# Altium project BMS_MASTER.PrjPcb
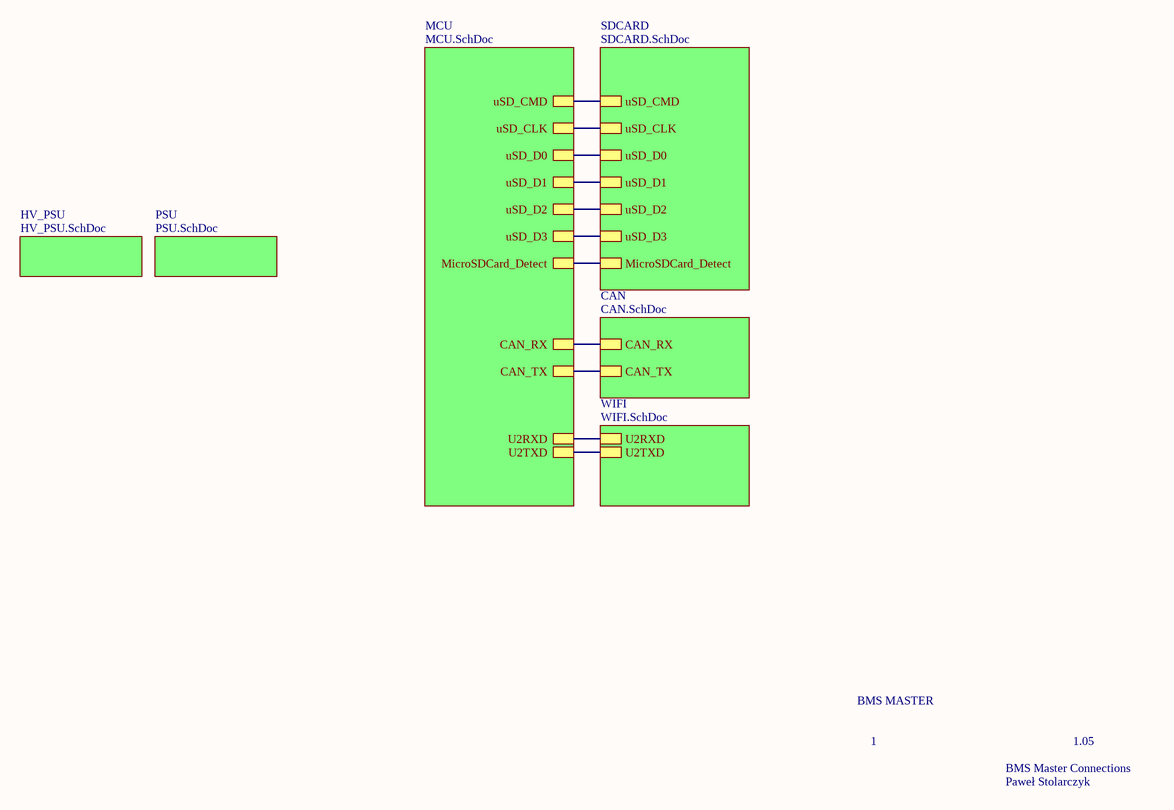
[diagram p0: BMS_MASTER.SchDoc]
7 sheets, 101 parts. Net scope: hierarchical (ports join the sheet entries above them; power ports are global).
Board file: BMS_MASTER.PcbDoc
Sheets:
  BMS_MASTER.SchDoc
    MCU = MCU.SchDoc
    PSU = PSU.SchDoc
    SDCARD = SDCARD.SchDoc
    WIFI = WIFI.SchDoc
    CAN = CAN.SchDoc
    HV_PSU = HV_PSU.SchDoc

## Sheet BMS_MASTER.SchDoc
size A4; SheetNumber: 1; SheetTotal: 7

### Sub-sheets
CAN = CAN.SchDoc: CAN_RX, CAN_TX
HV_PSU = HV_PSU.SchDoc: no entries
MCU = MCU.SchDoc: uSD_CMD, uSD_CLK, uSD_D0, uSD_D1, uSD_D2, uSD_D3, MicroSDCard_Detect, CAN_RX, CAN_TX, U2RXD, U2TXD
PSU = PSU.SchDoc: no entries
SDCARD = SDCARD.SchDoc: uSD_CMD, uSD_CLK, uSD_D0, uSD_D1, uSD_D2, uSD_D3, MicroSDCard_Detect
WIFI = WIFI.SchDoc: U2RXD, U2TXD

### Nets
CAN_RX: sheet MCU/CAN_RX, sheet CAN/CAN_RX
CAN_TX: sheet MCU/CAN_TX, sheet CAN/CAN_TX
IO16: sheet MCU/U2RXD, sheet WIFI/U2RXD
IO17: sheet MCU/U2TXD, sheet WIFI/U2TXD
PB6: sheet MCU/MicroSDCard_Detect, sheet SDCARD/MicroSDCard_Detect
PC8: sheet MCU/uSD_D0, sheet SDCARD/uSD_D0
PC9: sheet MCU/uSD_D1, sheet SDCARD/uSD_D1
PC10: sheet MCU/uSD_D2, sheet SDCARD/uSD_D2
PC11: sheet MCU/uSD_D3, sheet SDCARD/uSD_D3
PC12: sheet MCU/uSD_CLK, sheet SDCARD/uSD_CLK
PD2: sheet MCU/uSD_CMD, sheet SDCARD/uSD_CMD

### Notes on the sheet
- BMS MASTER
- 1
- BMS Master Connections
- 1.05
- Paweł Stolarczyk

## Sheet MCU.SchDoc
size A3; SheetNumber: 2; SheetTotal: 7
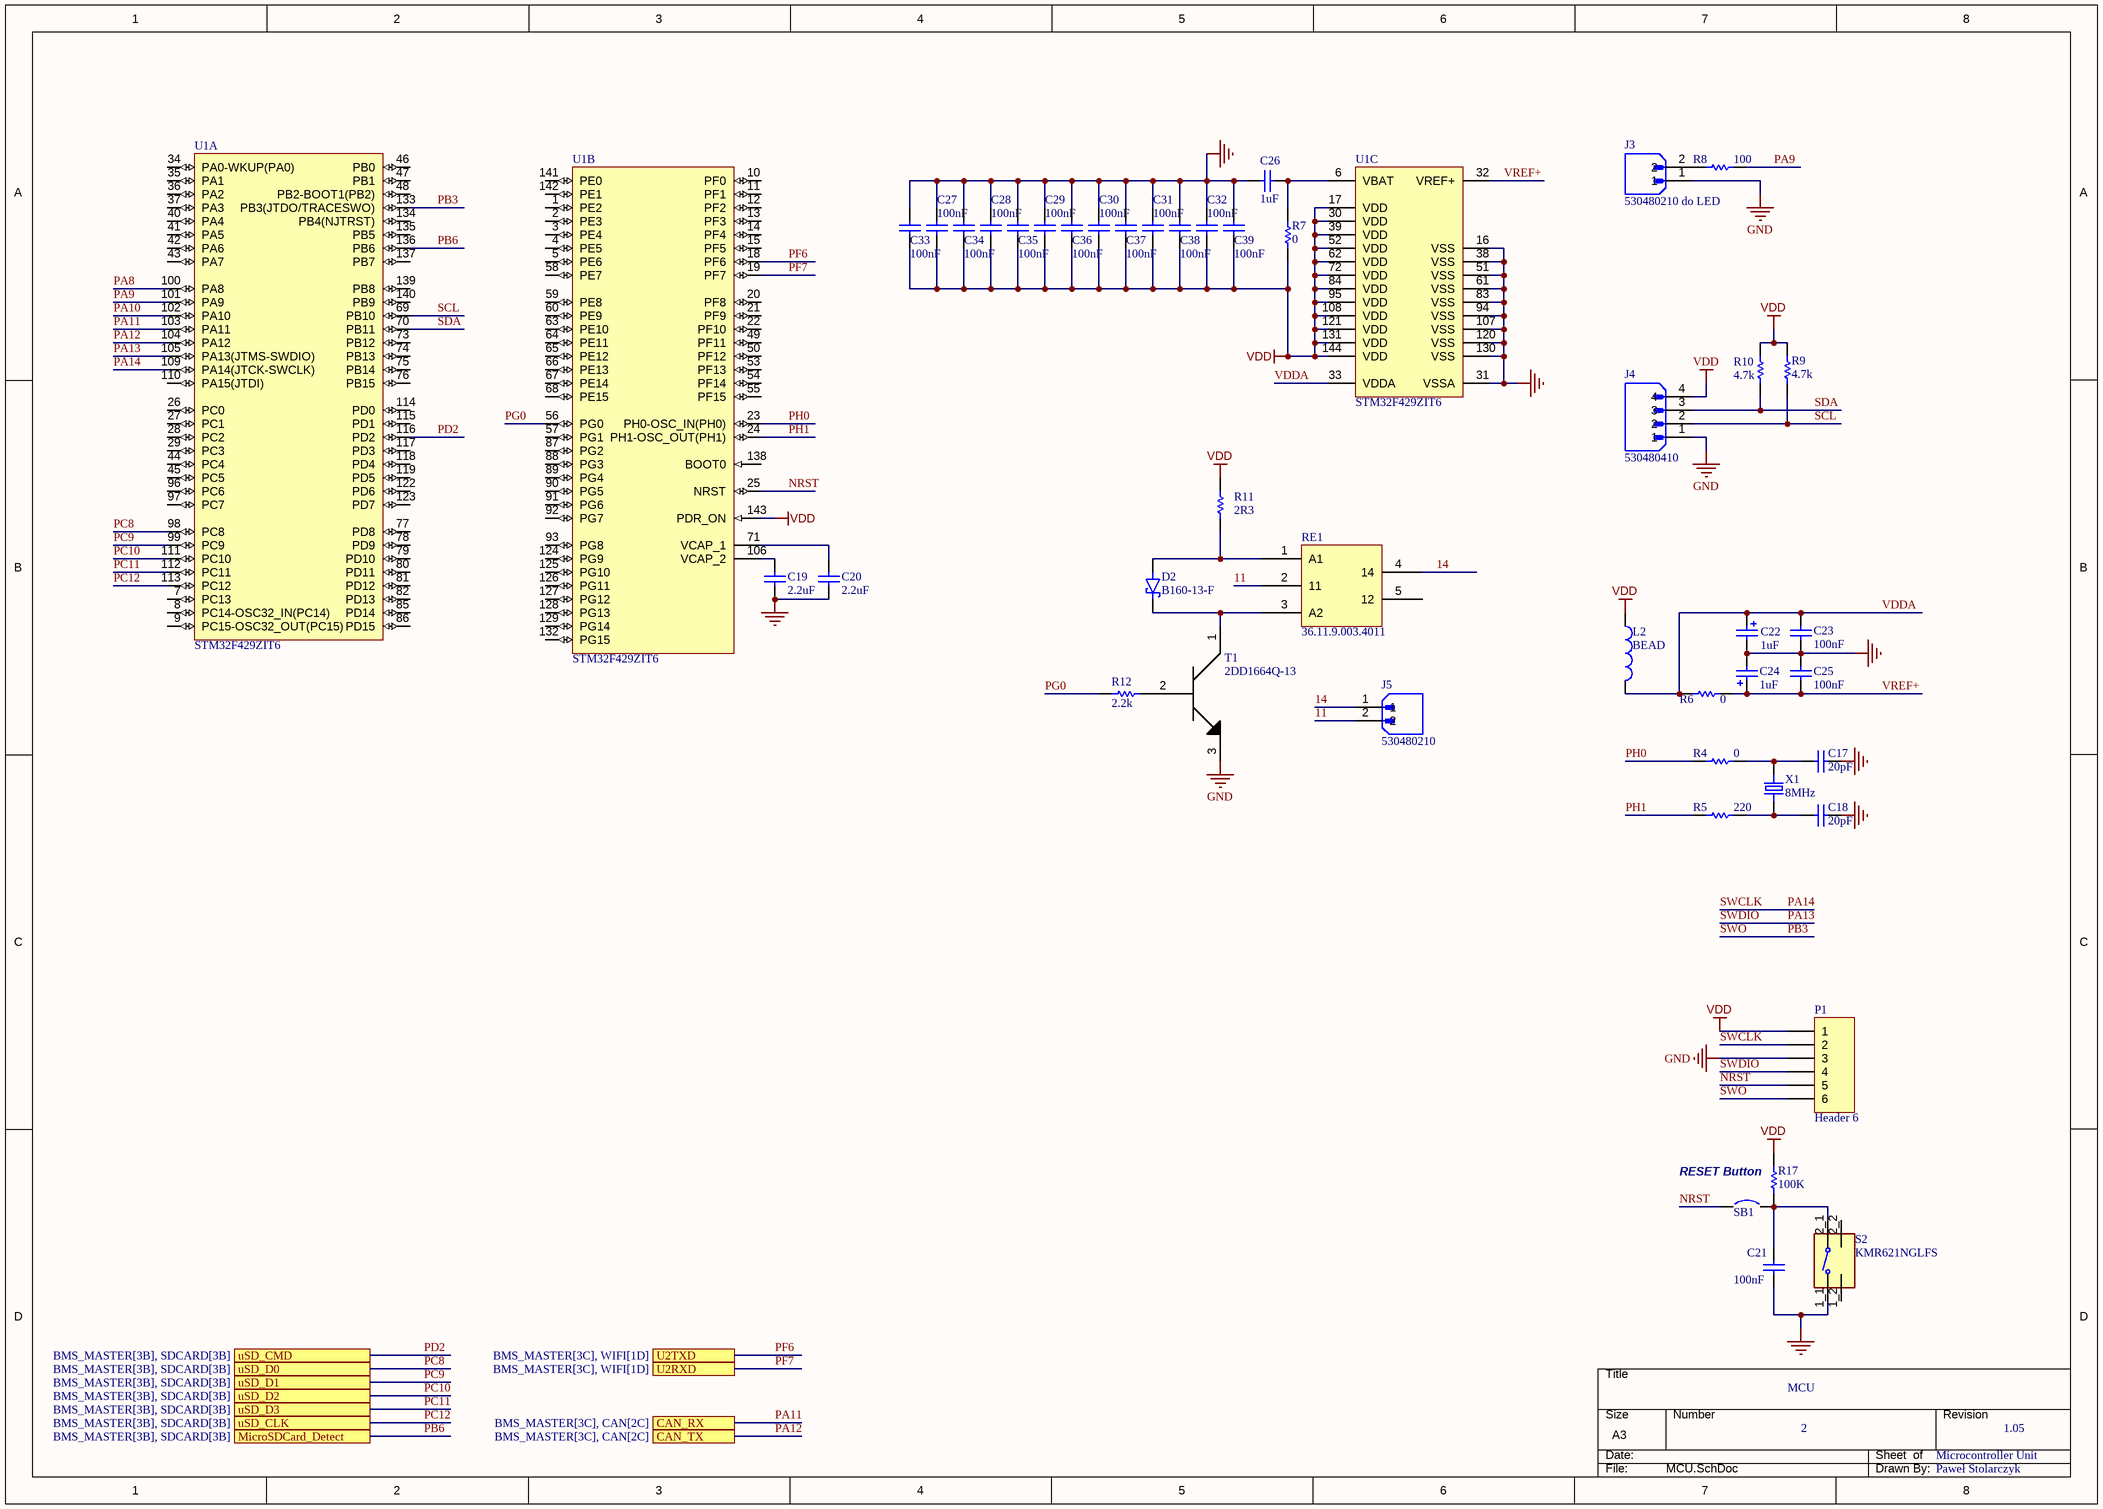
[diagram p1: MCU.SchDoc]

### Parts
C17  20pF  [0402]
C18  20pF  [0402]
C19  2.2uF  [C1206]
C20  2.2uF  [C1206]
C21  100nF  [0402]
C22  1uF  [C1206]
C23  100nF  [0402]
C24  1uF  [C1206]
C25  100nF  [0402]
C26  1uF  [C1206]
C27  100nF  [0402]
C28  100nF  [0402]
C29  100nF  [0402]
C30  100nF  [0402]
C31  100nF  [0402]
C32  100nF  [0402]
C33  100nF  [0402]
C34  100nF  [0402]
C35  100nF  [0402]
C36  100nF  [0402]
C37  100nF  [0402]
C38  100nF  [0402]
C39  100nF  [0402]
D2  B160-13-F  [DIODE_B160-13-F]
J3  530480210 do LED  [MOLEX_530480210]
J4  530480410  [MOLEX_530480410]
J5  530480210  [MOLEX_530480210]
L2  BEAD  [0402]
P1  Header 6  [HDR1X6]
R4  0  [0402]
R5  220  [0402]
R6  0  [0402]
R7  0  [0402]
R8  100  [0402]
R9  4.7k  [0402]
R10  4.7k  [0402]
R11  value 2R3  [C1206]  (hidden comment: Res1)
R12  2.2k  [0402]
R17  100K  [0402]
RE1  36.11.9.003.4011  [36.11.9.003.4011]
S2  KMR621NGLFS  [SW_KMR621NGLFS]
SB1  Circuit Breaker  [0402]  (value not drawn)
T1  2DD1664Q-13  [SOT150P410X160-3N]
U1  STM32F429ZIT6  [STM-LQFP144_N]  (parts A,B,C of 3)
X1  8MHz  [8M-49S-SR]

### Ports
CAN_RX (see BMS_MASTER[3C], CAN[2C]), CAN_TX (see BMS_MASTER[3C], CAN[2C]), MicroSDCard_Detect (see BMS_MASTER[3B], SDCARD[3B]), U2RXD (see BMS_MASTER[3C], WIFI[1D]), U2TXD (see BMS_MASTER[3C], WIFI[1D]), uSD_CLK (see BMS_MASTER[3B], SDCARD[3B]), uSD_CMD (see BMS_MASTER[3B], SDCARD[3B]), uSD_D0 (see BMS_MASTER[3B], SDCARD[3B]), uSD_D1 (see BMS_MASTER[3B], SDCARD[3B]), uSD_D2 (see BMS_MASTER[3B], SDCARD[3B]), uSD_D3 (see BMS_MASTER[3B], SDCARD[3B])

### Nets
GND: C17.2 C18.2 C19.2 C20.2 C21.1 C22.2 C23.1 C24.2 C25.2 C26.1 C27.2 C28.2 C29.2 C30.2 C31.2 C32.2 C33.2 C34.2 C35.2 C36.2 C37.2 C38.2 C39.2 J3.1 J4.1 P1.3 S2.1_1 T1.3 U1.16(VSS) U1.31(VSSA) U1.38(VSS) U1.51(VSS) U1.61(VSS) U1.83(VSS) U1.94(VSS) U1.107(VSS) U1.120(VSS) U1.130(VSS)
VDD: C27.1 C28.1 C29.1 C30.1 C31.1 C32.1 C33.1 C34.1 C35.1 C36.1 C37.1 C38.1 C39.1 J4.4 L2.1 P1.1 R7.1 R9.1 R10.1 R11.2 R17.2 U1.17(VDD) U1.30(VDD) U1.39(VDD) U1.52(VDD) U1.62(VDD) U1.72(VDD) U1.84(VDD) U1.95(VDD) U1.108(VDD) U1.121(VDD) U1.131(VDD) U1.143(PDR_ON) U1.144(VDD)
11: J5.2 RE1.2(11)
14: J5.1 RE1.4(14)
NRST: P1.5 SB1.1 U1.25(NRST)
PA8: U1.100(PA8)
PA9: R8.2 U1.101(PA9)
PA10: U1.102(PA10)
PA11: U1.103(PA11) ; port CAN_RX  [project net CAN_RX]
PA12: U1.104(PA12) ; port CAN_TX  [project net CAN_TX]
PA13: P1.4 U1.105(PA13(JTMS-SWDIO))  [also labelled SWDIO]
PA14: P1.2 U1.109(PA14(JTCK-SWCLK))  [also labelled SWCLK]
PB3: P1.6 U1.133(PB3(JTDO/TRACESWO))  [also labelled SWO]
PB6: U1.136(PB6) ; port MicroSDCard_Detect
PC8: U1.98(PC8) ; port uSD_D0
PC9: U1.99(PC9) ; port uSD_D1
PC10: U1.111(PC10) ; port uSD_D2
PC11: U1.112(PC11) ; port uSD_D3
PC12: U1.113(PC12) ; port uSD_CLK
PD2: U1.116(PD2) ; port uSD_CMD
PF6: U1.18(PF6) ; port U2TXD  [project net IO17]
PF7: U1.19(PF7) ; port U2RXD  [project net IO16]
PG0: R12.1 U1.56(PG0)
PH0: R4.1 U1.23(PH0-OSC_IN(PH0))
PH1: R5.1 U1.24(PH1-OSC_OUT(PH1))
SCL: J4.2 R9.2 U1.69(PB10)
SDA: J4.3 R10.2 U1.70(PB11)
VDDA: C22.1 C23.2 L2.2 R6.1 U1.33(VDDA)
VREF+: C24.1 C25.1 R6.2 U1.32(VREF+)
NetC17_1: C17.1 R4.2 X1.2
NetC18_1: C18.1 R5.2 X1.1
NetC19_1: C19.1 U1.106(VCAP_2)
NetC20_1: C20.1 U1.71(VCAP_1)
NetC21_2: C21.2 R17.1 S2.2_1 SB1.2
NetC26_2: C26.2 R7.2 U1.6(VBAT)
NetD2_1: D2.1(C) RE1.3(A2) T1.1
NetD2_2: D2.2(A) R11.1 RE1.1(A1)
NetJ3_2: J3.2 R8.1
NetR12_2: R12.2 T1.2

Not connected (* = marked no-connect by the designer): RE1 5(12); S2 1_2(1) 2_2(2); U1 1(PE2) 2(PE3) 3(PE4) 4(PE5) 5(PE6) 7(PC13) 8(PC14-OSC32_IN(PC14)) 9(PC15-OSC32_OUT(PC15)) 10(PF0) 11(PF1) 12(PF2) 13(PF3) 14(PF4) 15(PF5) 20(PF8) 21(PF9) 22(PF10) 26(PC0) 27(PC1) 28(PC2) 29(PC3) 34(PA0-WKUP(PA0)) 35(PA1) 36(PA2) 37(PA3) 40(PA4) 41(PA5) 42(PA6) 43(PA7) 44(PC4) 45(PC5) 46(PB0) 47(PB1) 48(PB2-BOOT1(PB2)) 49(PF11) 50(PF12) 53(PF13) 54(PF14) 55(PF15) 57(PG1) 58(PE7) 59(PE8) 60(PE9) 63(PE10) 64(PE11) 65(PE12) 66(PE13) 67(PE14) 68(PE15) 73(PB12) 74(PB13) 75(PB14) 76(PB15) 77(PD8) 78(PD9) 79(PD10) 80(PD11) 81(PD12) 82(PD13) 85(PD14) 86(PD15) 87(PG2) 88(PG3) 89(PG4) 90(PG5) 91(PG6) 92(PG7) 93(PG8) 96(PC6) 97(PC7) 110(PA15(JTDI)) 114(PD0) 115(PD1) 117(PD3) 118(PD4) 119(PD5) 122(PD6) 123(PD7) 124(PG9) 125(PG10) 126(PG11) 127(PG12) 128(PG13) 129(PG14) 132(PG15) 134(PB4(NJTRST)) 135(PB5) 137(PB7) 138(BOOT0) 139(PB8) 140(PB9) 141(PE0) 142(PE1)

### Notes on the sheet
- RESET Button
- MCU
- 2
- Microcontroller Unit
- 1.05
- Paweł Stolarczyk
- DWG. NO.
- REV.
- SHT.
- THIS DOCUMENT AND THE DATA DISCLOSED HEREIN OR HEREWITH IS THE PROPERTY OF ALTIUM LIMITED AND MAY BE FREELY DISTRIBUTED IN WHOLE. NO RIGHTS ARE RESERVED OR EXPRESS OR IMPLIED WARANTEE GIVEN.
- REVISION
- DESCRIPTION
- DATE
- APPROVED
- ENG:
- APPROVALS
- PROJECT
- DSN:
- CHK:
- REFERENCE DOCUMENTS
- PROJECT REVISION:
- TITLE
- DOCUMENT REVISION:
- DESIGN ITEM:
- BOM:
- FAB DWG:
- PCB DWG:
- ASSY DWG:
- SCALE:
- SIZE
- B
- CAGE CODE
- FILE NAME
- DWG NO.
- SHEET
- OF
- REV

### Library data of the parts
C17 C18 C26 = Capacitor_ST: Capacitor 0402 / 0603 / 0805; Value: 100nF; Revision: July-2002: Re-released for DXP Platform.
C19 C20 = Cap Low ESR: Low ESR Ceramic Capacitor (X7R); Order: CC1206KKX7R7BB225; Revision: July-2002: Re-released for DXP Platform.; Value: 2.2uF; Distrib: FARNELL; Manuf_Part_1: CC1206KKX7R7BB225; Manuf_1: www.yageo.com
C21 C23 C25 C27-C39 = Capacitor_ST: Capacitor 0402 / 0603 / 0805; Revision: July-2002: Re-released for DXP Platform.; Value: 100nF
C22 C24 = Cap Pol1: Polarized Capacitor (Radial); Value: 10uF; Published: 8-Jun-2000; Revision: July-2002: Re-released for DXP Platform.; Publisher: Altium Limited
D2 = B160-13-F: Diode Schottky 60V 1A Surface Mount SMA; MF: Diodes Inc.; Price: None; Availability: Unavailable; SnapEDA_Link: https://www.snapeda.com/parts/B160-13-F/Diodes%20Inc./view-part/248179/?ref=snap; MP: B160-13-F; Value: *; Package: DO-214 Diodes Inc.
J3 J5 = 530480210: Conn Shrouded Header (4 Sides) HDR 2 POS 1.25mm Solder RA Side Entry Thru-Hole PicoBladeâ„¢ Tray; MF: Molex; SnapEDA_Link: https://www.snapeda.com/parts/530480210/Molex/view-part/?ref=snap; Value: *; Purchase-URL: https://pricing.snapeda.com/search/part/530480210/?ref=eda; Check_prices: https://www.snapeda.com/parts/530480210/Molex/view-part/?ref=eda; Availability: In Stock; Price: None; MP: 530480210; Package: None
L2 = Inductor: Manuf_Part_1: FCM1608KF-601T03; Value: 100uH; Published: 8-Jun-2000; Revision: July-2002: Re-released for DXP Platform.; Publisher: Altium Limited; Order: FCM1608KF-601T03
P1 = Header 6: Header, 6-Pin; LatestRevisionDate: 17-Jul-2002; LatestRevisionNote: Re-released for DXP Platform.; Publisher: Altium Limited
R4-R10 R12 R17 = Resistor_ST: Resistor 0402 / 0603 / 0805; Value: 10K
R11 = Res1: Resistor; Published: 8-Jun-2000; LatestRevisionDate: 17-Jul-2002; LatestRevisionNote: Re-released for DXP Platform.; PackageReference: AXIAL-0.3; Publisher: Altium Limited; PackageDescription: Axial Device, Thru-Hole; 2 Leads; 0.3 in Pin Spacing
RE1 = 36.11.9.003.4011: Przekaźnik: elektromagnetyczny; SPDT; Ucewki : 3VDC; 15A; PCB; 25Ω
S2 = KMR621NGLFS: Tactile Switch SPST-NO Top Actuated Surface Mount; MF: C&K; Package: None; Value: *; Price: None; MP: KMR621NG LFS; SnapEDA_Link: https://www.snapeda.com/parts/KMR621NG%20LFS/C%26K/view-part/2720743/?ref=snap; Availability: Unavailable
SB1 = Circuit Breaker: Solder: YES; Published: 24-Mar-1999; Revision: July-2002: Re-released for DXP Platform.; Publisher: Altium Limited
T1 = 2DD1664Q-13: Transistor: NPN; bipolar; 32V; 1A; 1W; SOT89; automotive industry
U1 = STM32F429ZIT6: ARM Cortex-M4 32-bit MCU+FPU, 225 DMIPS, 2048 kB Flash, 256 kB Internal RAM, 114 I/Os, 144-pin LQFP, -40 to 85 degC, Tray; Manufacturer: STMicroelectronics; D/A Converter: 2x12-bit; FLASH Size (Prog) (kB): 2048; I/Os (High Current): 114; Internal RAM Size (kB): 256; Operating Frequency(F) (Processor speed) (MHz): 180; Supply Voltage(Vcc) max (V): 3.6; Supply Voltage(Vcc) min (V): 1.8; DatasheetVersion: Rev. 2; PackageVersion: Rev. 4, 06/2013; PackageReference: LQFP144; PackageDescription: 144-Pin Low Profile Quad Flat Package, 20 x 20 mm Body, 0.5 mm Pitch; Supplier 1: Digi-Key; Supplier Part Number 1: 497-14053-ND; Supplier 2: Newark; Supplier Part Number 2: 06X3676; Supplier 3: Mouser; Supplier Part Number 3: 511-STM32F429ZIT6; Core: ARM Cortex-M4; Packing: Tray; Mounting Technology: Surface Mount; PartNumber: STM32F429ZIT6; ComponentLink1Description: Manufacturer URL; ComponentLink1URL: http://www.st.com/web/en/home.html; ComponentLink2Description: Datasheet; ComponentLink2URL: http://www.st.com/st-web-ui/static/active/en/resource/technical/document/data_brief/DM00053488.pdf; ComponentLink3Description: Package Specification; ComponentLink3URL: http://www.st.com/st-web-ui/static/active/en/resource/technical/document/datasheet/DM00037051.pdf
X1 = 8M-49S-SR: 8MHz; ±30ppm; 20pF; THT; HC49-S; MF: ECS Inc.; MP: ECS-160-20-4VX; SnapEDA_Link: https://www.snapeda.com/parts/ECS-160-20-4VX/ECS%20Inc./view-part/47293/?ref=snap; Availability: Unavailable; Value: *; Price: None; Package: HC49/US ECS International
J4 = 530480410: Availability: Unavailable; Price: None; Package: None; Value: *; MP: 530480410

## Sheet PSU.SchDoc
size A4; SheetNumber: 3; SheetTotal: 7; SPICEModelCacheIJFRPAVB: <root> / <DocumentId>IJFRPAVB</DocumentId> / </root>
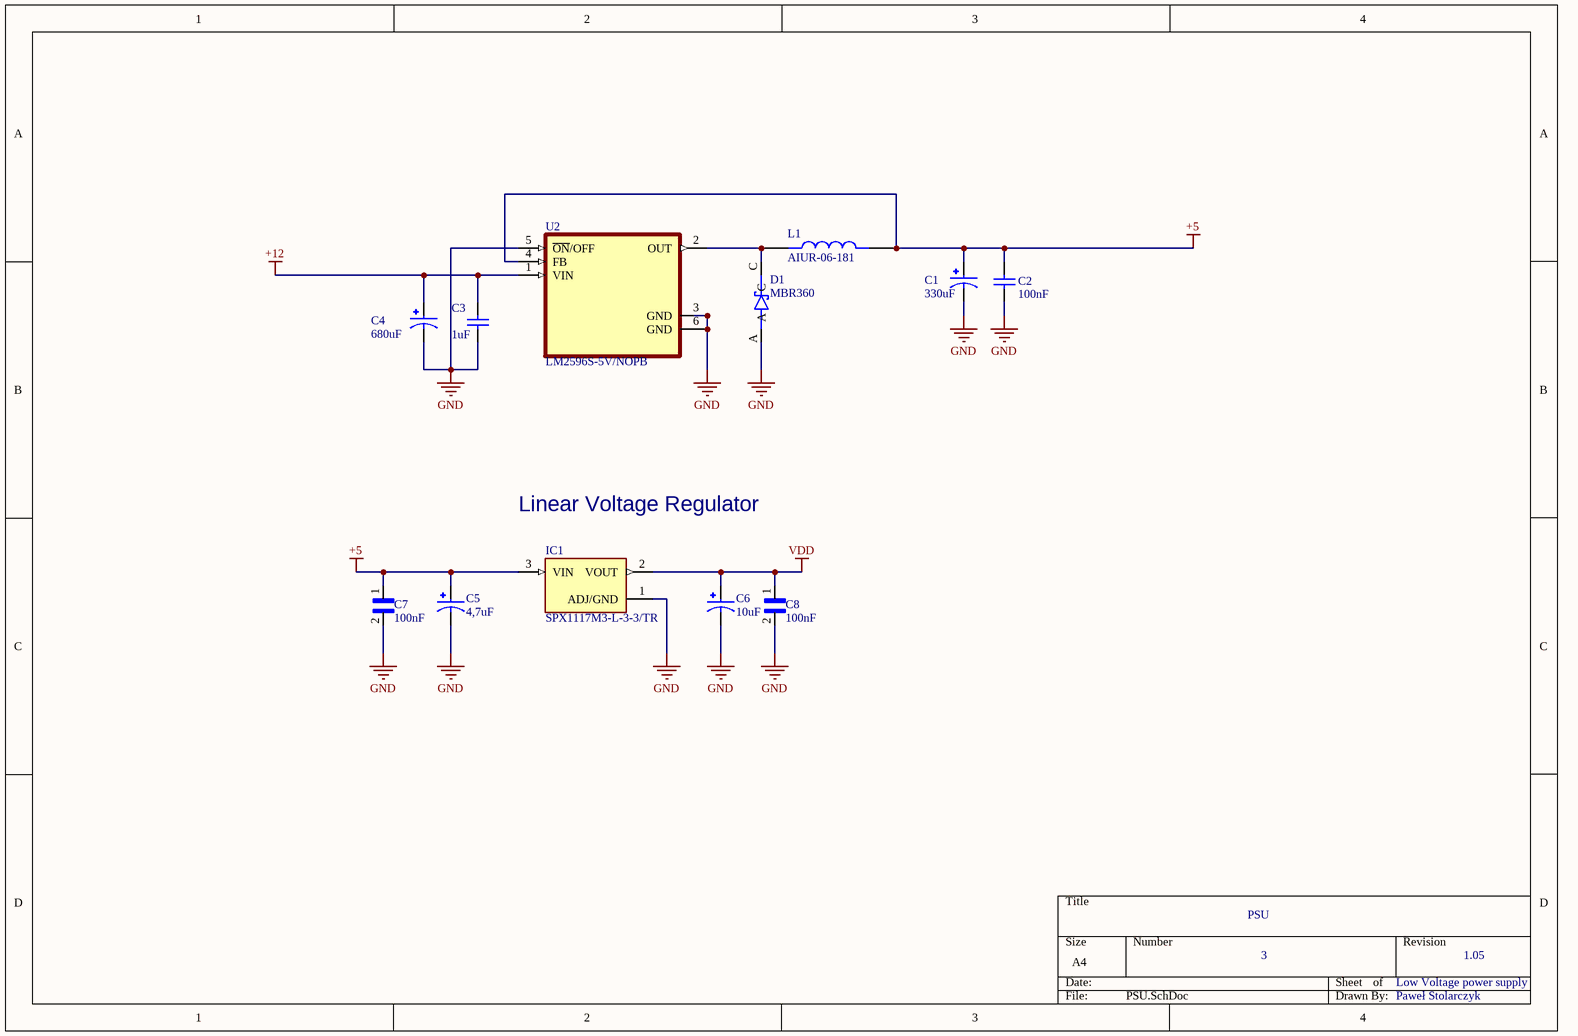
[diagram p2: PSU.SchDoc]

### Parts
C1  330uF  [CAP_16SVP330M]
C2  value 100nF  [0402]  (hidden comment: Cap)
C3  value 1uF  [0402]  (hidden comment: Cap)
C4  680uF  [CAP_16SVPC100M]
C5  4,7uF  [CAP_EEE1CA100SR]
C6  10uF  [CAP_EEE1CA100SR]
C7  100nF  [CAPC1608X90N]
C8  100nF  [CAPC1608X90N]
D1  MBR360  [DIOAD1950W125L950D560]
IC1  SPX1117M3-L-3-3/TR  [SOT230P700X180-3N]
L1  AIUR-06-181  [INDRD500W70D850H750]
U2  LM2596S-5V/NOPB  [VREG_LM2596S-ADJ/NOPB]

### Nets
+5: C1.1 C2.2 C5.1 C7.1 IC1.3(VIN) L1.2 U2.4(FB)
+12: C3.2 C4.1 U2.1(VIN)
GND: C1.2 C2.1 C3.1 C4.2 C5.2 C6.2 C7.2 C8.2 D1.A IC1.1(ADJ/GND) U2.3(GND) U2.5(~{ON}/OFF) U2.6(GND)
VDD: C6.1 C8.1 IC1.2(VOUT)
NetD1_C: D1.C L1.1 U2.2(OUT)

### Notes on the sheet
- Linear Voltage Regulator
- PSU
- 3
- Low Voltage power supply
- 1.05
- Paweł Stolarczyk

### Library data of the parts
C1 = 16SVP330M: Value: *; Package: None; Price: None; MP: 16SVP330M; Availability: Unavailable
C2 C3 = Cap: Capacitor; Published: 8-Jun-2000; LatestRevisionDate: 17-Jul-2002; LatestRevisionNote: Re-released for DXP Platform.; PackageReference: RAD-0.3; Publisher: Altium Limited; PackageDescription: Radial Cap, Thru-Hole; 2 Leads; 0.3 in Pin Spacing
C4 = 16SVPC100M: Package: None; MP: 16SVPC100M; Value: *; Price: None; Availability: Unavailable
C5 C6 = EEE1CA100SR: 10ÂµF 16V Aluminum Electrolytic Capacitors Radial, Can - SMD 2000 Hrs @ 85Â°C; MF: Panasonic; Digi-Key_Part_Number: PCE3878CT-ND; Check_prices: https://www.snapeda.com/parts/EEE1CA100SR/Panasonic/view-part/?ref=eda; Value: *; MP: EEE1CA100SR; Package: RADIAL-2 Panasonic; SnapEDA_Link: https://www.snapeda.com/parts/EEE1CA100SR/Panasonic/view-part/?ref=snap
C7 C8 = C0603C104J4RAC: 0.1ÂµF Â±5% 16V Ceramic Capacitor X7R 0603 (1608 Metric); MF: KEMET; MP: C0603C104J4RAC; SnapEDA_Link: https://www.snapeda.com/parts/C0603C104J4RAC/KEMET/view-part/1763758/?ref=snap; Availability: Warning; Package: 0603 KEMET; Check_prices: https://www.snapeda.com/parts/C0603C104J4RAC/KEMET/view-part/1763758/?ref=eda; Value: *; Price: None
D1 = MBR360: Diode Schottky 60V 3A Through Hole DO-201AD; MF: ON Semiconductor; MP: MBR360G; Check_prices: https://www.snapeda.com/parts/MBR360G/ON%20Semiconductor/view-part/53063/?ref=eda; Value: *; Price: None; Availability: Good; Package: AXIAL LEAD-2 ON Semiconductor; Purchase-URL: https://pricing.snapeda.com/search/part/MBR360G/?ref=eda; SnapEDA_Link: https://www.snapeda.com/parts/MBR360G/ON%20Semiconductor/view-part/53063/?ref=snap
IC1 = SPX1117M3-L-3-3/TR: Linear Voltage Regulator IC Positive Fixed 1 Output 800mA SOT-223; MF: MaxLinear, Inc.; Value: *; SnapEDA_Link: https://www.snapeda.com/parts/SPX1117M3-L-3-3/TR/MaxLinear%2C%20Inc./view-part/376705/?ref=snap; Package: SOT-223 Exar; MP: SPX1117M3-L-3-3/TR; Price: None; Availability: Unavailable
L1 = AIUR-06-181: FIXED IND 180UH 1.6A 228 MOHM TH; MF: Abracon LLC; Check_prices: https://www.snapeda.com/parts/AIUR-06-181/Abracon+LLC/view-part/?ref=eda; SnapEDA_Link: https://www.snapeda.com/parts/AIUR-06-181/Abracon+LLC/view-part/?ref=snap; Availability: In Stock; Value: *; Price: None; MP: AIUR-06-181; Package: Radial Abracon; Purchase-URL: https://pricing.snapeda.com/search/part/AIUR-06-181/?ref=eda
U2 = LM2596S-ADJ/NOPB: SIMPLE SWITCHER&reg; 4.5V to 40V, 3A Low Component Count Step-Down Regulator; MF: Texas Instruments; Price: None; Package: TO-263-5 Texas Instruments; Purchase-URL: https://pricing.snapeda.com/search/part/LM2596S-ADJ/NOPB/?ref=eda; Availability: In Stock; SnapEDA_Link: https://www.snapeda.com/parts/LM2596S-ADJ/NOPB/Texas+Instruments/view-part/?ref=snap; Value: *; MP: LM2596S-ADJ/NOPB; Check_prices: https://www.snapeda.com/parts/LM2596S-ADJ/NOPB/Texas+Instruments/view-part/?ref=eda

## Sheet SDCARD.SchDoc
size A4; SheetNumber: 4; SheetTotal: 7
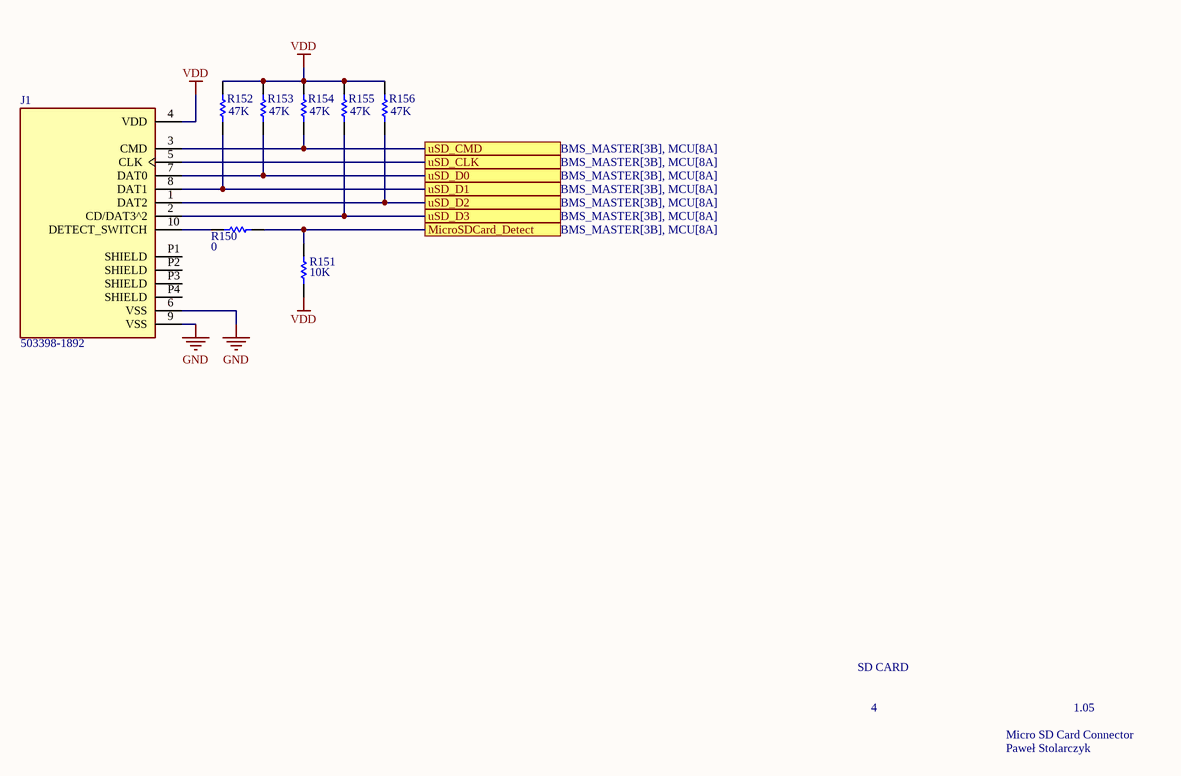
[diagram p3: SDCARD.SchDoc]

### Parts
J1  503398-1892  [MOLEX_503398-1892]
R150  value 0  [0402]  (hidden comment: Res1)
R151  value 10K  [0402]  (hidden comment: Res1)
R152  value 47K  [0402]  (hidden comment: Res1)
R153  value 47K  [0402]  (hidden comment: Res1)
R154  value 47K  [0402]  (hidden comment: Res1)
R155  value 47K  [0402]  (hidden comment: Res1)
R156  value 47K  [0402]  (hidden comment: Res1)

### Ports
MicroSDCard_Detect (see BMS_MASTER[3B], MCU[8A]), uSD_CLK (see BMS_MASTER[3B], MCU[8A]), uSD_CMD (see BMS_MASTER[3B], MCU[8A]), uSD_D0 (see BMS_MASTER[3B], MCU[8A]), uSD_D1 (see BMS_MASTER[3B], MCU[8A]), uSD_D2 (see BMS_MASTER[3B], MCU[8A]), uSD_D3 (see BMS_MASTER[3B], MCU[8A])

### Nets
GND: J1.6(VSS) J1.9(VSS)
VDD: J1.4(VDD) R151.2 R152.2 R153.2 R154.2 R155.2 R156.2
PB6: R150.2 R151.1 ; port MicroSDCard_Detect
PC8: J1.7(DAT0) R153.1 ; port uSD_D0
PC9: J1.8(DAT1) R152.1 ; port uSD_D1
PC10: J1.1(DAT2) R156.1 ; port uSD_D2
PC11: J1.2(CD/DAT3^2) R155.1 ; port uSD_D3
PC12: J1.5(CLK) ; port uSD_CLK
PD2: J1.3(CMD) R154.1 ; port uSD_CMD
NetJ1_10: J1.10(DETECT_SWITCH) R150.1

Not connected (* = marked no-connect by the designer): J1 P1(SHIELD) P2(SHIELD) P3(SHIELD) P4(SHIELD)

### Notes on the sheet
- SD CARD
- 4
- Micro SD Card Connector
- 1.05
- Paweł Stolarczyk

### Library data of the parts
J1 = 503398-1892: 9 (8 + 1) Position Card Connector Secure Digital - microSDâ„¢ Surface Mount, Right Angle Gold; MP: 5033981892; MF: Molex; Check_prices: https://www.snapeda.com/parts/5033981892/Molex/view-part/?ref=eda; Value: *; Availability: In Stock; Price: None; Package: None; SnapEDA_Link: https://www.snapeda.com/parts/5033981892/Molex/view-part/?ref=snap; Purchase-URL: https://pricing.snapeda.com/search/part/5033981892/?ref=eda
R150-R156 = Res1: Resistor; Published: 8-Jun-2000; LatestRevisionDate: 17-Jul-2002; LatestRevisionNote: Re-released for DXP Platform.; PackageReference: AXIAL-0.3; Publisher: Altium Limited; PackageDescription: Axial Device, Thru-Hole; 2 Leads; 0.3 in Pin Spacing

## Sheet WIFI.SchDoc
size A4; SheetNumber: 5; SheetTotal: 7
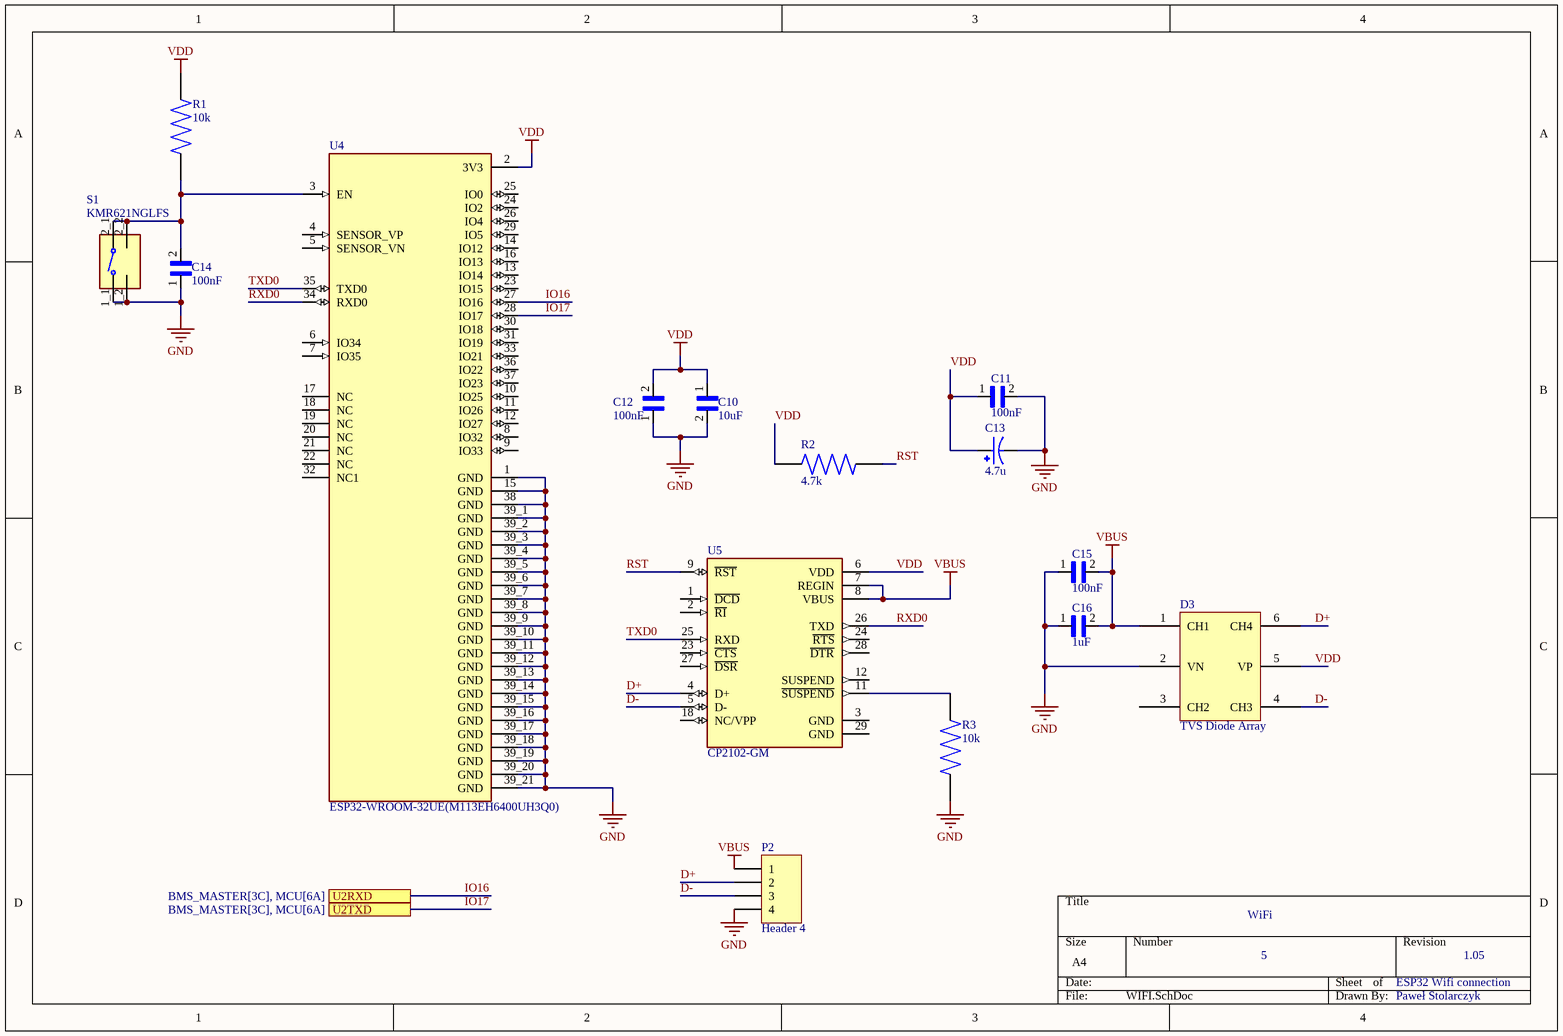
[diagram p4: WIFI.SchDoc]

### Parts
C10  10uF  [CAPC1608X90N]
C11  100nF  [CAPC1608X90N]
C12  100nF  [CAPC1608X90N]
C13  4.7u  [CAP_EEE1CA100SR]
C14  100nF  [CAPC1608X90N]
C15  100nF  [CAPC1608X90N]
C16  1uF  [CAPC1608X90N]
D3  TVS Diode Array  [SOT23-6-V2]
P2  Header 4  [HDR1X4]
R1  10k  [0402]
R2  4.7k  [0402]
R3  10k  [0402]
S1  KMR621NGLFS  [SW_KMR621NGLFS]
U4  ESP32-WROOM-32UE(M113EH6400UH3Q0)  [MODULE_ESP32-WROOM-32UE(M113EH6400UH3Q0)]
U5  CP2102-GM  [QFN50P500X500X100-29N]

### Ports
U2RXD (see BMS_MASTER[3C], MCU[6A]), U2TXD (see BMS_MASTER[3C], MCU[6A])

### Nets
GND: C10.2 C11.2 C12.1 C13.2 C14.1 C15.1 C16.1 D3.2(VN) P2.4 R3.2 S1.1_1 S1.1_2 U4.1(GND) U4.15(GND) U4.38(GND) U4.39_1(GND) U4.39_2(GND) U4.39_3(GND) U4.39_4(GND) U4.39_5(GND) U4.39_6(GND) U4.39_7(GND) U4.39_8(GND) U4.39_9(GND) U4.39_10(GND) U4.39_11(GND) U4.39_12(GND) U4.39_13(GND) U4.39_14(GND) U4.39_15(GND) U4.39_16(GND) U4.39_17(GND) U4.39_18(GND) U4.39_19(GND) U4.39_20(GND) U4.39_21(GND)
VBUS: C15.2 C16.2 D3.1(CH1) P2.1 U5.7(REGIN) U5.8(VBUS)
VDD: C10.1 C11.1 C12.2 C13.1 D3.5(VP) R1.1 R2.2 U4.2(3V3) U5.6(VDD)
D+: D3.6(CH4) P2.2 U5.4(D+)
D-: D3.4(CH3) P2.3 U5.5(D-)
IO16: U4.27(IO16) ; port U2RXD
IO17: U4.28(IO17) ; port U2TXD
RST: R2.1 U5.9(~{RST})
RXD0: U4.34(RXD0) U5.26(TXD)
TXD0: U4.35(TXD0) U5.25(RXD)
NetC14_2: C14.2 R1.2 S1.2_1 S1.2_2 U4.3(EN)
NetR3_1: R3.1 U5.11(~{SUSPEND})

Not connected (* = marked no-connect by the designer): D3 3(CH2); U4 4(SENSOR_VP) 5(SENSOR_VN) 6(IO34) 7(IO35) 8(IO32) 9(IO33) 10(IO25) 11(IO26) 12(IO27) 13(IO14) 14(IO12) 16(IO13) 17(NC) 18(NC) 19(NC) 20(NC) 21(NC) 22(NC) 23(IO15) 24(IO2) 25(IO0) 26(IO4) 29(IO5) 30(IO18) 31(IO19) 32(NC1) 33(IO21) 36(IO22) 37(IO23); U5 1(~{DCD}) 2(~{RI}) 3(GND) 12(SUSPEND) 18(NC/VPP) 23(~{CTS}) 24(~{RTS}) 27(~{DSR}) 28(~{DTR}) 29(GND)

### Notes on the sheet
- WiFi
- 5
- ESP32 Wifi connection
- 1.05
- Paweł Stolarczyk

### Library data of the parts
C10-C12 C14-C16 = C0603C104J4RAC: as C7 on sheet PSU; MP: C0603C104J4RAC; SnapEDA_Link: https://www.snapeda.com/parts/C0603C104J4RAC/KEMET/view-part/1763758/?ref=snap; Availability: Warning; Package: 0603 KEMET; Check_prices: https://www.snapeda.com/parts/C0603C104J4RAC/KEMET/view-part/1763758/?ref=eda; Value: *; Price: None
C13 = EEE1CA100SR: as C5 on sheet PSU; Digi-Key_Part_Number: PCE3878CT-ND; Check_prices: https://www.snapeda.com/parts/EEE1CA100SR/Panasonic/view-part/?ref=eda; Value: *; MP: EEE1CA100SR; Package: RADIAL-2 Panasonic; SnapEDA_Link: https://www.snapeda.com/parts/EEE1CA100SR/Panasonic/view-part/?ref=snap
D3 = AOZ8105: Ultra-Low Capacitance TVS Diode Array
P2 = Header 4: Header, 4-Pin; LatestRevisionDate: 17-Jul-2002; LatestRevisionNote: Re-released for DXP Platform.; Publisher: Altium Limited
R1-R3 = RK73H1JTTD1102F: Rezystor, SMD 11 kOhm, Â± 1 %, 0603 ¦ KOA RK73H1JTTD1102F @ Metal film resistor SMD (Rezystor, SMD 11 kOhm, Â± 1 %, 0603 Rezystory SMD /; Package: None; Price: None; Value: *; MP: RK73H1JTTD1102F; Availability: Unavailable
S1 = KMR621NGLFS: as S2 on sheet MCU; Package: None; Value: *; Price: None; MP: KMR621NG LFS; SnapEDA_Link: https://www.snapeda.com/parts/KMR621NG%20LFS/C%26K/view-part/2720743/?ref=snap; Availability: Unavailable
U4 = ESP32-WROOM-32UE(M113EH6400UH3Q0): Bluetooth, WiFi 802.11b/g/n, Bluetooth v4.2 +EDR, Class 1, 2 and 3 Transceiver Module 2.4GHz ~ 2.5GHz Antenna Not Included, U.FL Surface Mount; MF: Espressif Systems; Price: None; Check_prices: https://www.snapeda.com/parts/ESP32-WROOM-32UE(M113EH6400UH3Q0)/Espressif+Systems/view-part/?ref=eda; Value: *; Package: None; SnapEDA_Link: https://www.snapeda.com/parts/ESP32-WROOM-32UE(M113EH6400UH3Q0)/Espressif+Systems/view-part/?ref=snap; MP: ESP32-WROOM-32UE(M113EH6400UH3Q0); Availability: Not in stock
U5 = CP2102-GM: USB Bridge, USB to UART USB 2.0 UART Interface 28-QFN (5x5); MF: Silicon Labs; Price: None; Availability: In Stock; MP: CP2102-GM; Package: QFN-28 Silicon Labs; SnapEDA_Link: https://www.snapeda.com/parts/CP2102-GM/Silicon+Labs/view-part/?ref=snap; Check_prices: https://www.snapeda.com/parts/CP2102-GM/Silicon+Labs/view-part/?ref=eda; Value: *; Purchase-URL: https://pricing.snapeda.com/search/part/CP2102-GM/?ref=eda

## Sheet CAN.SchDoc
size A4; SheetNumber: 6; SheetTotal: 7
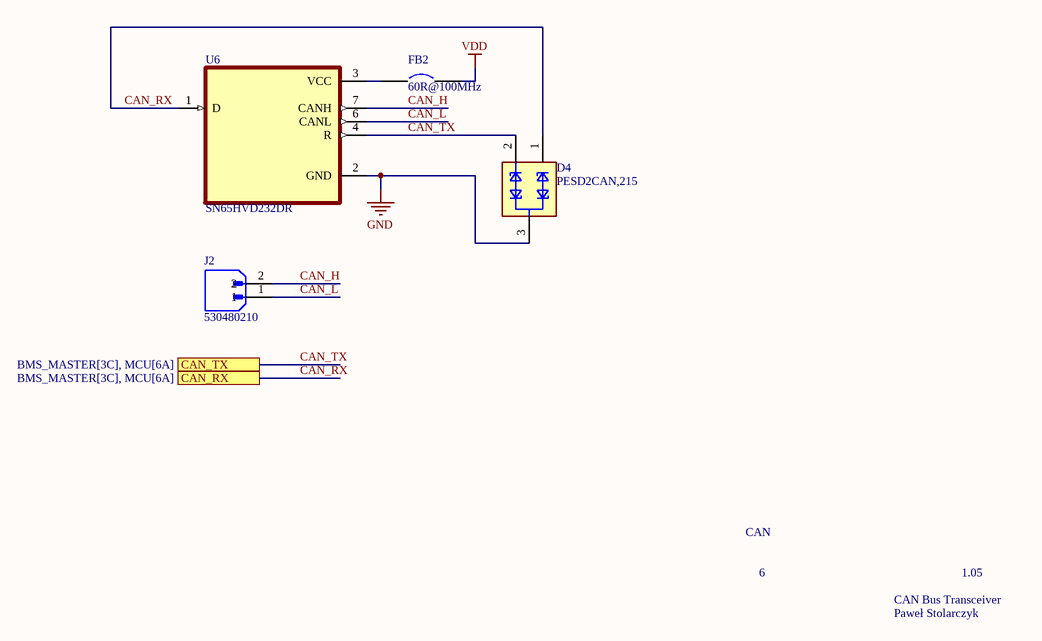
[diagram p5: CAN.SchDoc]

### Parts
D4  PESD2CAN,215  [SOT95P230X110-3N]
FB2  60R@100MHz  [0402]
J2  530480210  [MOLEX_530480210]
U6  SN65HVD232DR  [SOIC127P599X175-8N]

### Ports
CAN_RX (see BMS_MASTER[3C], MCU[6A]), CAN_TX (see BMS_MASTER[3C], MCU[6A])

### Nets
GND: D4.3 U6.2(GND)
VDD: FB2.2
CAN_H: J2.2 U6.7(CANH)
CAN_L: J2.1 U6.6(CANL)
CAN_RX: D4.1 U6.1(D) ; port CAN_RX
CAN_TX: D4.2 U6.4(R) ; port CAN_TX
NetFB2_1: FB2.1 U6.3(VCC)

### Notes on the sheet
- CAN
- 6
- CAN Bus Transceiver
- 1.05
- Paweł Stolarczyk

### Library data of the parts
D4 = PESD2CAN,215: ESD Suppressor Diode TVS Bi-Dir 24V Automotive 3-Pin SOT-23 T/R; MF: Nexperia USA Inc.; SnapEDA_Link: https://www.snapeda.com/parts/PESD2CAN,215/Nexperia/view-part/?ref=snap; Package: TO-236-3 Nexperia USA Inc.; MP: PESD2CAN,215; Check_prices: https://www.snapeda.com/parts/PESD2CAN,215/Nexperia/view-part/?ref=eda; Purchase-URL: https://pricing.snapeda.com/search/part/PESD2CAN,215/?ref=eda; Price: None; Value: *; Availability: In Stock
FB2 = Circuit Breaker: Published: 24-Mar-1999; LatestRevisionDate: 17-Jul-2002; LatestRevisionNote: Re-released for DXP Platform.; PackageReference: SPST-2; Publisher: Altium Limited; PackageDescription: Switch; 2 Leads
J2 = 530480210: as J3 on sheet MCU; SnapEDA_Link: https://www.snapeda.com/parts/530480210/Molex/view-part/?ref=snap; Value: *; Purchase-URL: https://pricing.snapeda.com/search/part/530480210/?ref=eda; Check_prices: https://www.snapeda.com/parts/530480210/Molex/view-part/?ref=eda; Availability: In Stock; Price: None; MP: 530480210; Package: None
U6 = SN65HVD232DR: 3.3 V CAN Transceiver 8-SOIC -40 to 85; MF: Texas Instruments; Texas_Instruments-Purchase-URL: https://snapeda.com/shop?store=Texas+Instruments&id=184570; Price: None; Mouser-Purchase-URL: https://snapeda.com/shop?store=Mouser&id=184570; Availability: Good; Package: SOIC-8 Texas Instruments; SnapEDA_Link: https://www.snapeda.com/parts/SN65HVD232DR/Texas%20Instruments/view-part/184570/?ref=snap; DigiKey-Purchase-URL: https://snapeda.com/shop?store=DigiKey&id=184570; MP: SN65HVD232DR; Value: *; Arrow_Electronics-Purchase-URL: https://snapeda.com/shop?store=Arrow+Electronics&id=184570

## Sheet HV_PSU.SchDoc
size A4; SheetNumber: 7; SheetTotal: 7
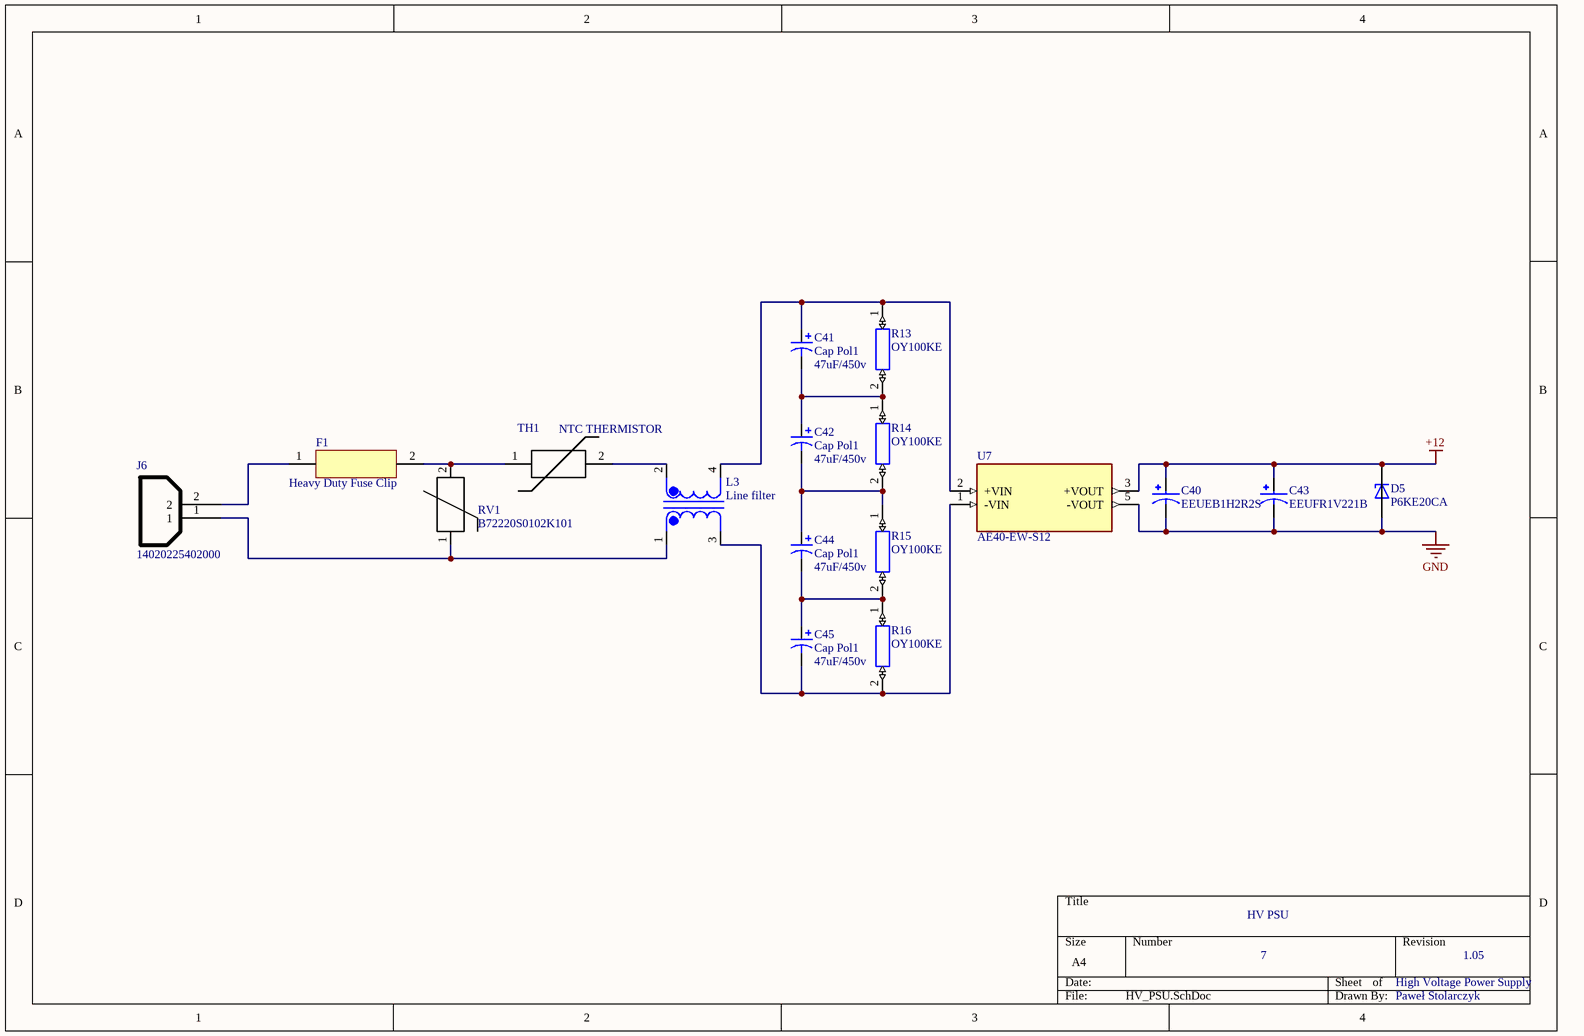
[diagram p6: HV_PSU.SchDoc]

### Parts
C40  EEUEB1H2R2S  [CAPPRD200W50D500H1100]
C41  Cap Pol1  value 47uF/450v  [RB7.6-15]
C42  Cap Pol1  value 47uF/450v  [RB7.6-15]
C43  EEUFR1V221B  [CAPPRD500W60D800H1150]
C44  Cap Pol1  value 47uF/450v  [RB7.6-15]
C45  Cap Pol1  value 47uF/450v  [RB7.6-15]
D5  P6KE20CA  [DIOAD1300W80L670D310]
F1  Heavy Duty Fuse Clip  [8040.2012.01]
J6  14020225402000  [14020225402000]
L3  Line filter  [SCF29XV-070-1R2A030JV]
R13  OY100KE  [RESAD4700W80L1900D700]
R14  OY100KE  [RESAD4700W80L1900D700]
R15  OY100KE  [RESAD4700W80L1900D700]
R16  OY100KE  [RESAD4700W80L1900D700]
RV1  B72220S0102K101  [VAR_B72220S0102K101]
TH1  NTC THERMISTOR  [MF72-10D20M]
U7  AE40-EW-S12  [CONV_AE40-EW-S12]

### Nets
+12: C40.P C43.P D5.C U7.3(+VOUT)
GND: C40.N C43.N D5.A U7.5(-VOUT)
NetC41_1: C41.1 L3.4 R13.1 U7.2(+VIN)
NetC41_2: C41.2 C42.1 R13.2 R14.1
NetC42_2: C42.2 C44.1 R14.2 R15.1
NetC44_2: C44.2 C45.1 R15.2 R16.1
NetC45_2: C45.2 L3.3 R16.2 U7.1(-VIN)
NetF1_1: F1.1 J6.2
NetF1_2: F1.2 RV1.2 TH1.1
NetJ6_1: J6.1 L3.1 RV1.1
NetL3_2: L3.2 TH1.2

### Notes on the sheet
- HV PSU
- 7
- High Voltage Power Supply
- 1.05
- Paweł Stolarczyk

### Library data of the parts
C40 = EEUEB1H2R2S: CAPACITOR, 2.2UF, 50V, 5X11MM; Capacitance:2.2F; Capacitance Tolerance: 20%; Voltage Rating:50V; Life Time @ Temperature:5000 hours @ 105C; Height:11mm; Diameter:5mm; Capacitor Terminals:Radial Leaded; Lead Spacing:2mm; Operating Temperature Range:-40C to +105C; AC Ripple Current:15mA; Capacitor Mounting:Through Hole; MF: Panasonic; Package: RADIAL-2 Panasonic; Availability: No availability data; MP: EEUEB1H2R2S; SnapEDA_Link: https://www.snapeda.com/parts/EEUEB1H2R2S/Panasonic/view-part/5793710/?ref=snap; Value: *; Check_prices: https://www.snapeda.com/parts/EEUEB1H2R2S/Panasonic/view-part/5793710/?ref=eda; Price: None
C41 C42 C44 C45 = Cap Pol1: Polarized Capacitor (Radial); Published: 8-Jun-2000; LatestRevisionDate: 17-Jul-2002; LatestRevisionNote: Re-released for DXP Platform.; PackageReference: RB7.6-15; Publisher: Altium Limited; PackageDescription: Polarized Capacitor (Radial); 2 Leads
C43 = EEUFR1V221B: Aluminum Electrolytic Capacitors - Radial Leaded 35VDC 220uF 20% L/S=5mm; MF: Panasonic; MP: EEU-FR1V221B; Purchase-URL: https://pricing.snapeda.com/search/part/EEU-FR1V221B/?ref=eda; Package: RADIAL-2 Panasonic; Value: *; Availability: In Stock; Price: None; SnapEDA_Link: https://www.snapeda.com/parts/EEU-FR1V221B/Panasonic/view-part/6222305/?ref=snap; Check_prices: https://www.snapeda.com/parts/EEU-FR1V221B/Panasonic/view-part/6222305/?ref=eda
D5 = P6KE20CA: 600W, 20V, 5%, Bidirectional, TVS; MF: Taiwan Semiconductor; Purchase-URL: https://pricing.snapeda.com/search/part/P6KE20CA/?ref=eda; Package: DO-15 Taiwan Semiconductor; Availability: In Stock; Value: *; MP: P6KE20CA; Check_prices: https://www.snapeda.com/parts/P6KE20CA/Taiwan+Semiconductor/view-part/?ref=eda; Price: None; SnapEDA_Link: https://www.snapeda.com/parts/P6KE20CA/Taiwan+Semiconductor/view-part/?ref=snap
F1 = 8040.2012.01: THT; 10x38mm; 15A
L3 = SCF29XV-070-1R2A030JV: THT; 9,9mH; 19,2mΩ; -40÷150°C; SCF; MF: KEMET; MP: SCF-02-1300; Package: Vertical-4 KEMET; Digi-Key_Purchase_URL: https://www.digikey.com/product-detail/en/kemet/SCF-02-1300/399-10776-ND/4290842?utm_source=snapeda&utm_medium=aggregator&utm_campaign=symbol; Value: *; SnapEDA_Link: https://www.snapeda.com/parts/SCF-02-1300/KEMET/view-part/1536060/?ref=snap; Digi-Key_Part_Number: 399-10776-ND
R13-R16 = OY100KE: 10 Ohms Â±10% 2W Through Hole Resistor Axial Moisture Resistant, Pulse Withstanding Ceramic; MF: Ohmite; Availability: Good; Check_prices: https://www.snapeda.com/parts/OY100KE/Ohmite/view-part/1373894/?ref=eda; SnapEDA_Link: https://www.snapeda.com/parts/OY100KE/Ohmite/view-part/1373894/?ref=snap; MP: OY100KE; Price: None; Purchase-URL: https://pricing.snapeda.com/search/part/OY100KE/?ref=eda; Package: Axial Ohmite; Value: *
RV1 = B72220S0102K101: Var MOV 1100VAC/1465VDC 6500A 1800V Thru-Hole Radial Automotive Bulk; MF: TDK ELECTRONICS; SnapEDA_Link: https://www.snapeda.com/parts/B72220S0102K101/TM+Electronics/view-part/?ref=snap; Availability: In Stock; MP: B72220S0102K101; Price: None; Check_prices: https://www.snapeda.com/parts/B72220S0102K101/TM+Electronics/view-part/?ref=eda; Package: None; Purchase-URL: https://pricing.snapeda.com/search/part/B72220S0102K101/?ref=eda; Value: *
TH1 = MF72-10D20M: 10Ω; 23mm; ±20%; THT; 2700K
U7 = AE40-EW-S12: 40 W, 6:1 Input Range, Single Regulated Output,  7 Pin DIP, 4000 Vdc Isolation, Dc-Dc Converter; MF: CUI Inc.; CUI_purchase_URL: https://www.cui.com/product/dc-dc-converters/isolated/ae40-ew-series?utm_source=snapeda.com&utm_medium=referral&utm_campaign=snapedaBOM; SnapEDA_Link: https://www.snapeda.com/parts/AE40-EW-S12/CUI/view-part/2854828/?ref=snap; Availability: Bad; Price: None; Package: DIP-7 CUI; Check_prices: https://www.snapeda.com/parts/AE40-EW-S12/CUI/view-part/2854828/?ref=eda; Value: *; Purchase-URL: https://pricing.snapeda.com/search/part/AE40-EW-S12/?ref=eda; MP: AE40-EW-S12

## Nets that join several sheets
+12: PSU (C3.2 C4.1 U2.1), HV_PSU (C40.P C43.P D5.C U7.3)
GND: MCU (38 pins), PSU (13 pins), SDCARD (J1.6 J1.9), WIFI (36 pins), CAN (D4.3 U6.2), HV_PSU (C40.N C43.N D5.A U7.5)
VDD: MCU (34 pins), PSU (C6.1 C8.1 IC1.2), SDCARD (7 pins), WIFI (9 pins), CAN (FB2.2)
CAN_RX: MCU (U1.103), CAN (D4.1 U6.1)
CAN_TX: MCU (U1.104), CAN (D4.2 U6.4)
IO16: MCU (U1.19), WIFI (U4.27)
IO17: MCU (U1.18), WIFI (U4.28)
PB6: MCU (U1.136), SDCARD (R150.2 R151.1)
PC8: MCU (U1.98), SDCARD (J1.7 R153.1)
PC9: MCU (U1.99), SDCARD (J1.8 R152.1)
PC10: MCU (U1.111), SDCARD (J1.1 R156.1)
PC11: MCU (U1.112), SDCARD (J1.2 R155.1)
PC12: MCU (U1.113), SDCARD (J1.5)
PD2: MCU (U1.116), SDCARD (J1.3 R154.1)